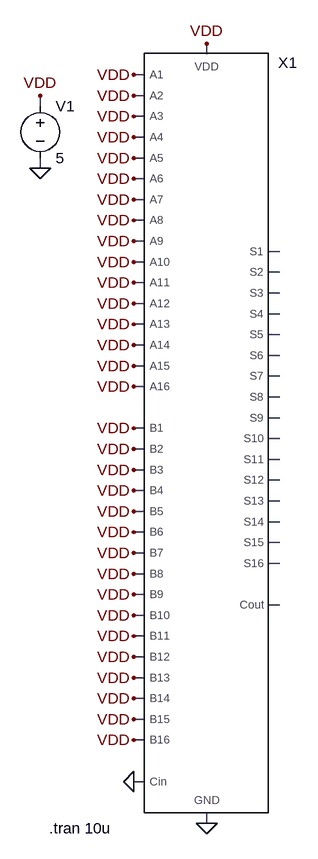
[diagram p0: schematic knowlesTB.asc]
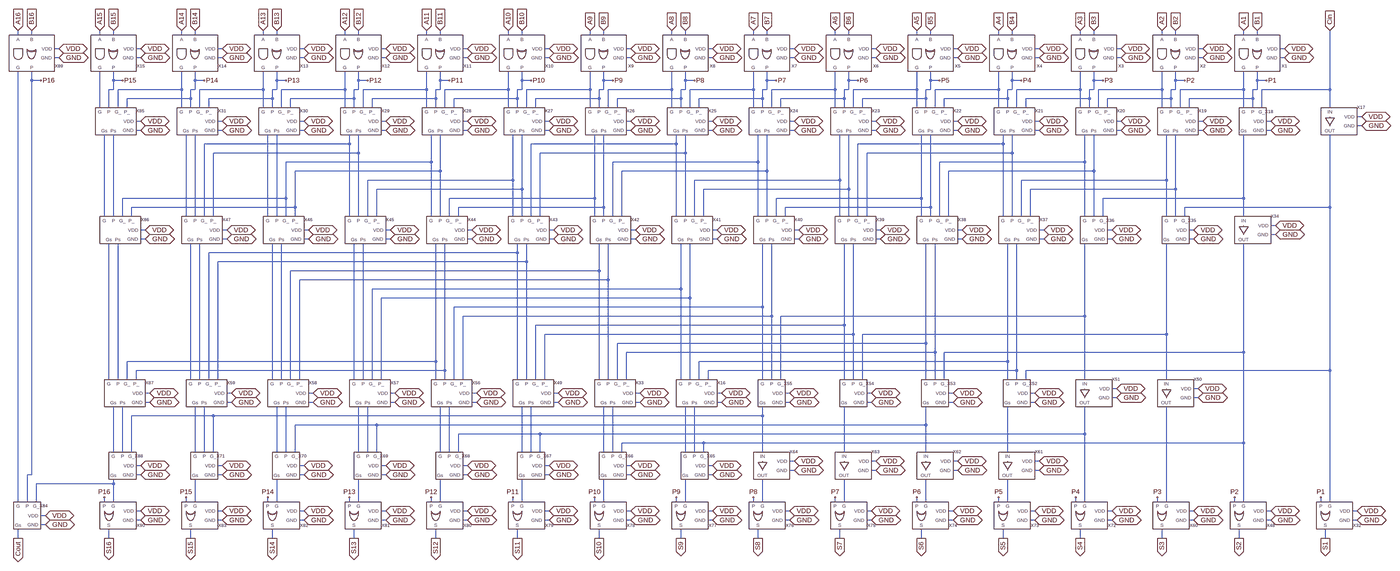
[diagram p1: sub-circuit knowles.asc, whole sheet]
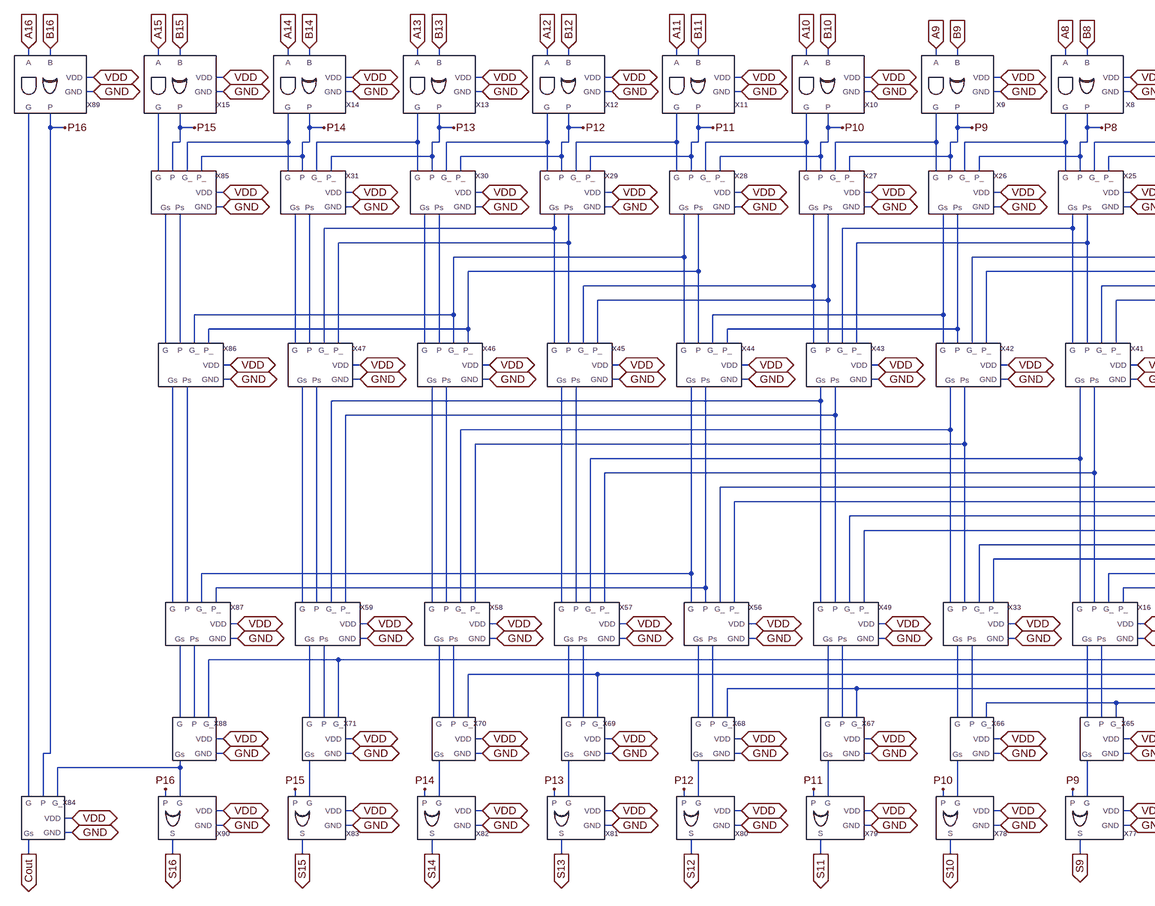
[diagram p2: sub-circuit knowles.asc, part, row 1 of 1, column 1 of 2]
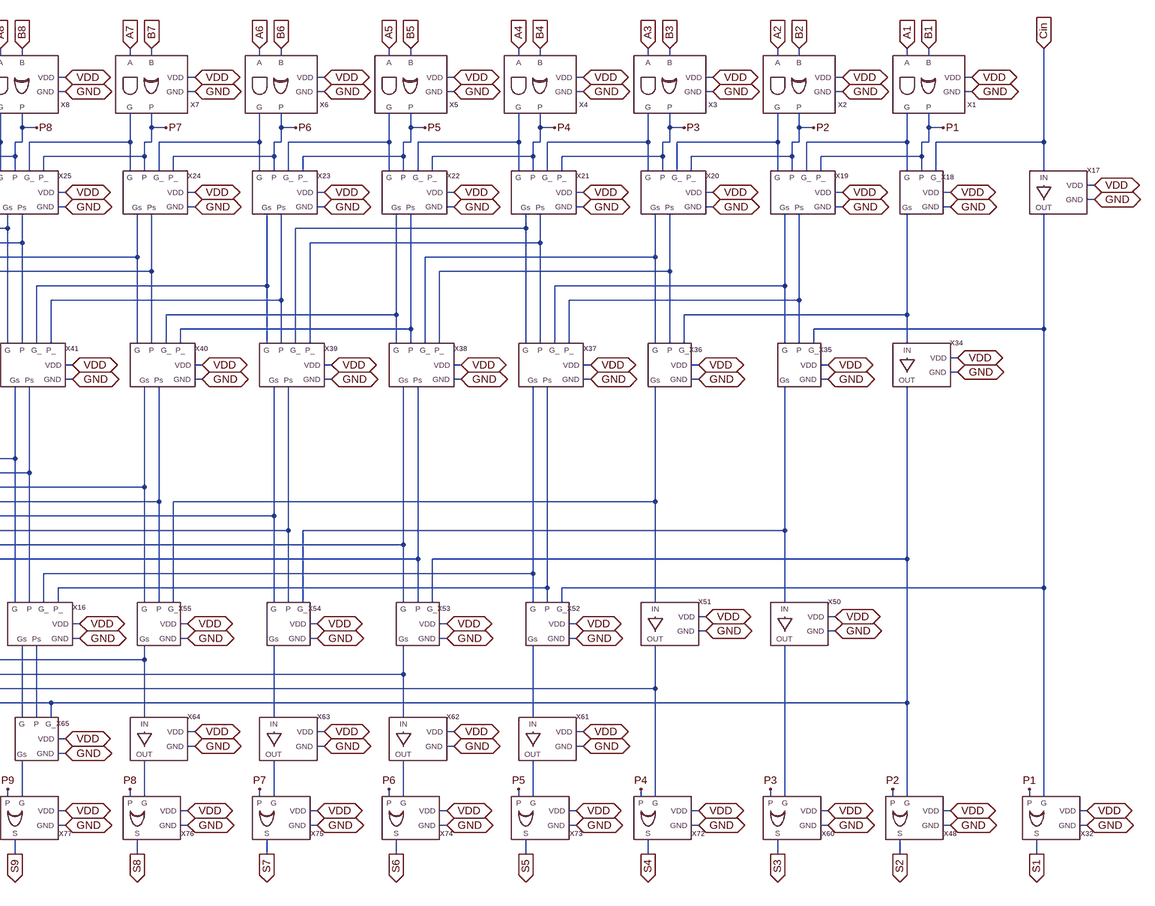
[diagram p3: sub-circuit knowles.asc, part, row 1 of 1, column 2 of 2]
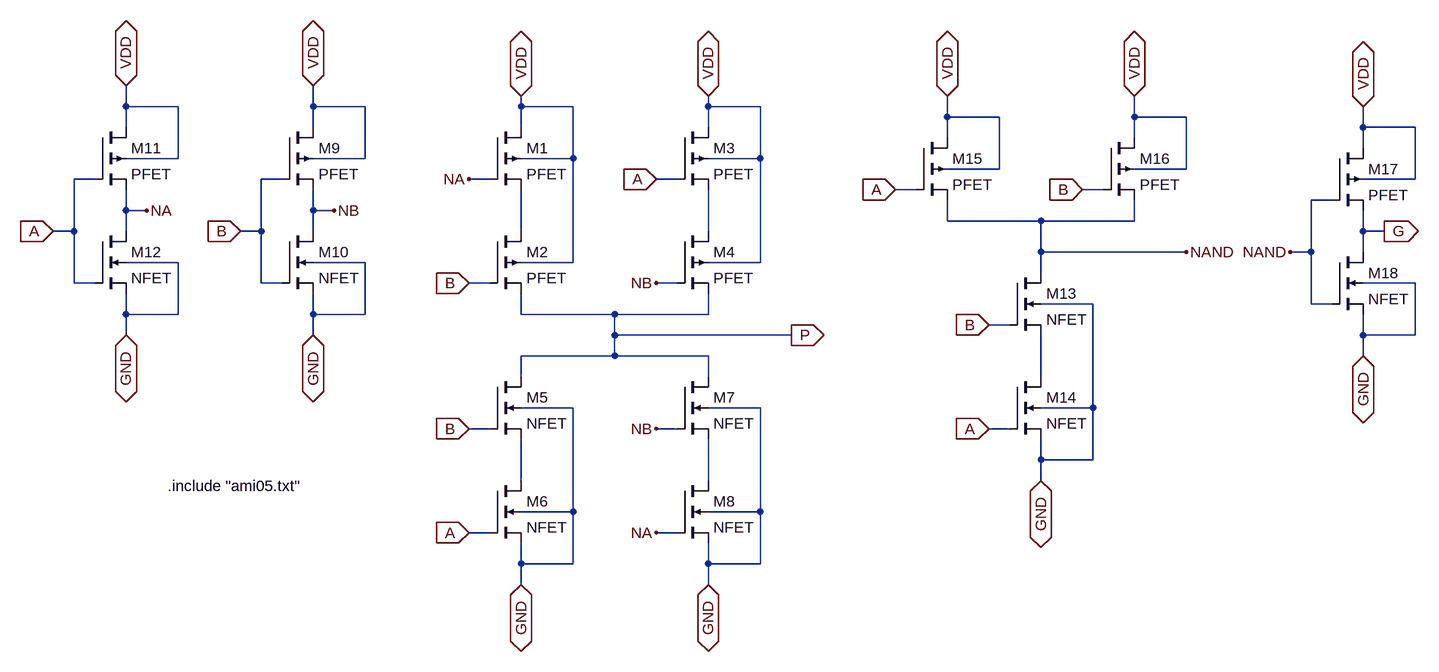
[diagram p4: sub-circuit bitwise.asc]
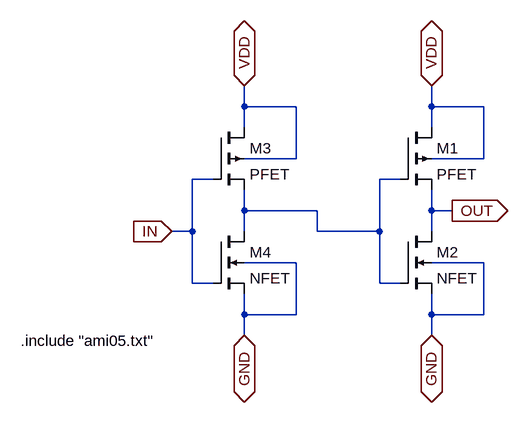
[diagram p5: sub-circuit buffer.asc]
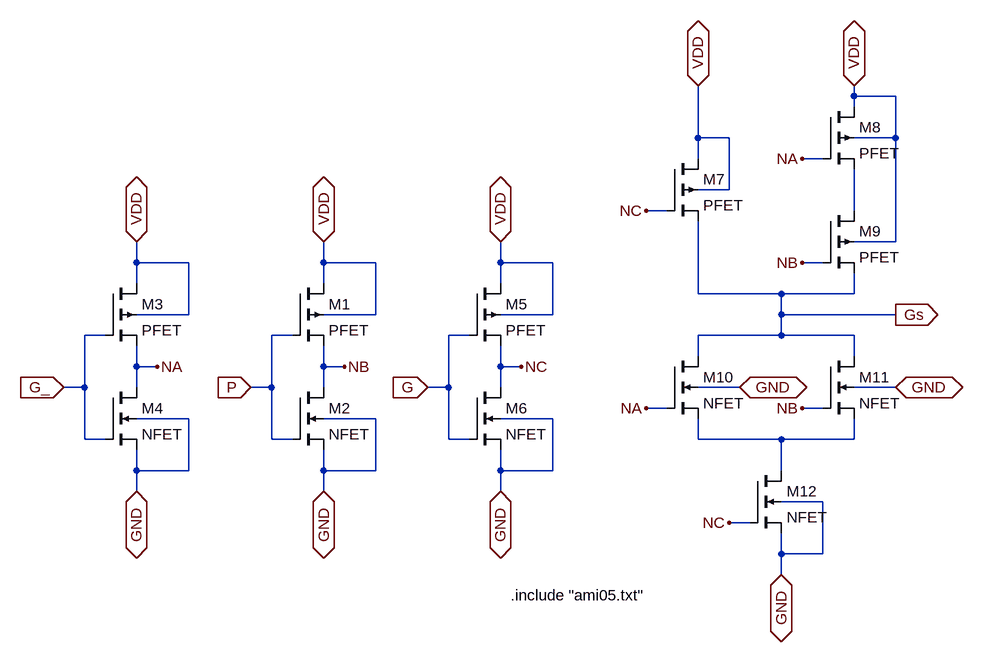
[diagram p6: sub-circuit gray.asc]
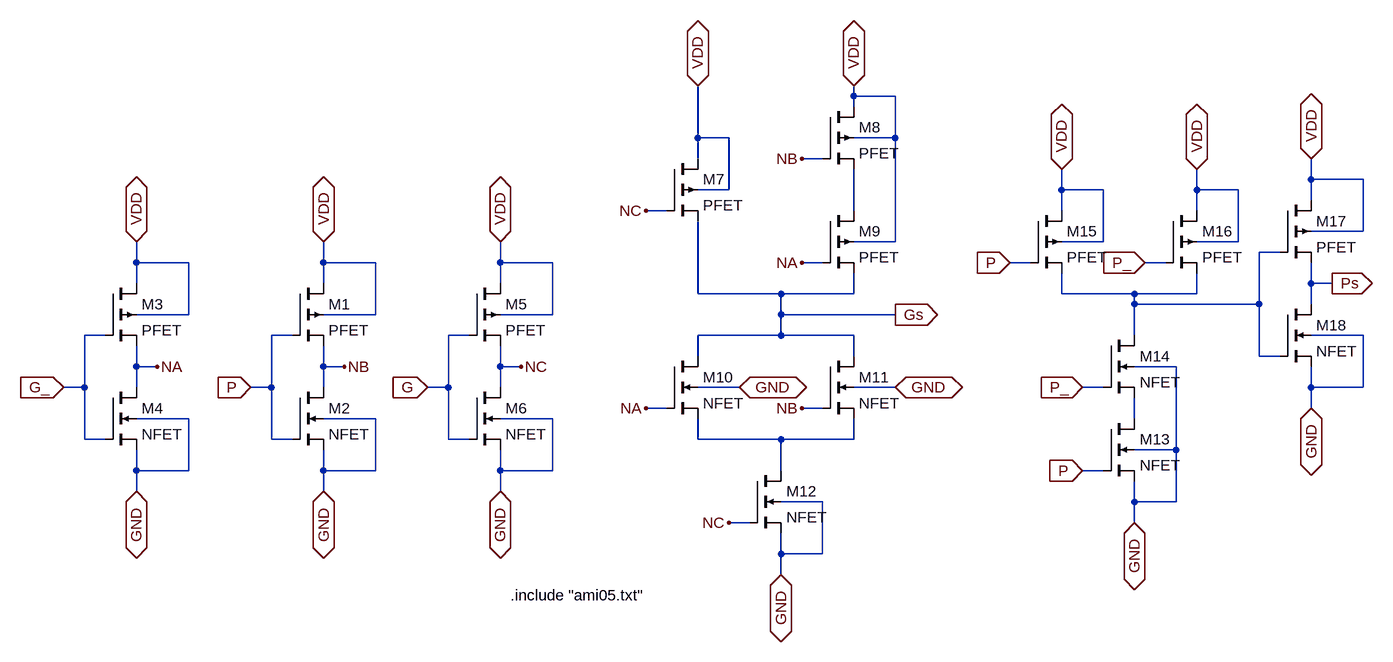
[diagram p7: sub-circuit black.asc]
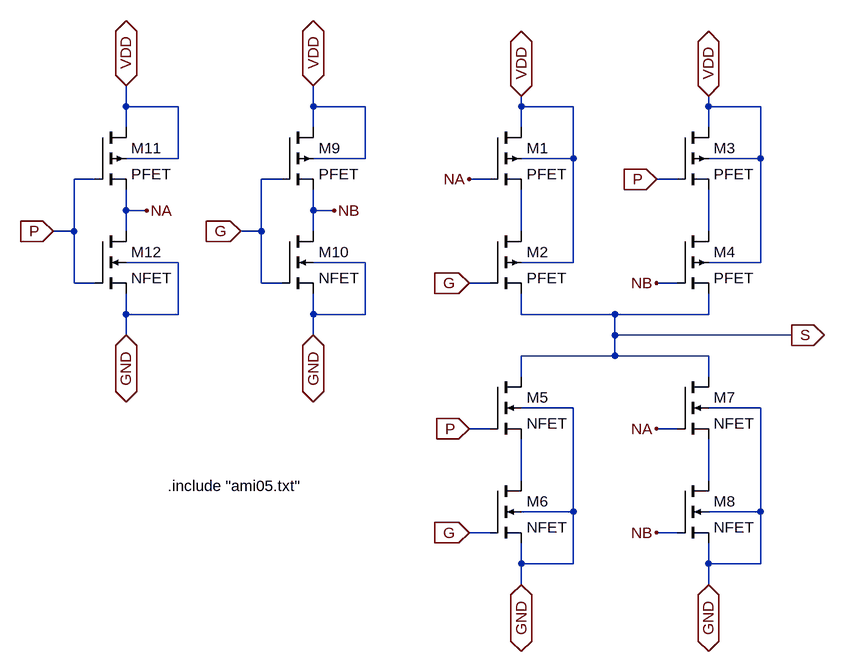
[diagram p8: sub-circuit sum.asc]
knowlesTB.asc, the LTspice schematic file:
Version 4
SHEET 1 880 856
WIRE 192 -368 192 -384
WIRE 96 -336 80 -336
WIRE 96 -304 80 -304
WIRE -64 -288 -64 -304
WIRE 96 -272 80 -272
WIRE 96 -240 80 -240
WIRE 96 -208 80 -208
WIRE -64 -192 -64 -208
WIRE 96 -176 80 -176
WIRE 96 -144 80 -144
WIRE 96 -112 80 -112
WIRE 96 -80 80 -80
WIRE 304 -64 288 -64
WIRE 96 -48 80 -48
WIRE 304 -32 288 -32
WIRE 96 -16 80 -16
WIRE 304 0 288 0
WIRE 96 16 80 16
WIRE 304 32 288 32
WIRE 96 48 80 48
WIRE 304 64 288 64
WIRE 96 80 80 80
WIRE 304 96 288 96
WIRE 96 112 80 112
WIRE 304 128 288 128
WIRE 96 144 80 144
WIRE 304 160 288 160
WIRE 304 192 288 192
WIRE 96 208 80 208
WIRE 304 224 288 224
WIRE 96 240 80 240
WIRE 304 256 288 256
WIRE 96 272 80 272
WIRE 304 288 288 288
WIRE 96 304 80 304
WIRE 304 320 288 320
WIRE 96 336 80 336
WIRE 304 352 288 352
WIRE 96 368 80 368
WIRE 304 384 288 384
WIRE 96 400 80 400
WIRE 304 416 288 416
WIRE 96 432 80 432
WIRE 96 464 80 464
WIRE 304 480 288 480
WIRE 96 496 80 496
WIRE 96 528 80 528
WIRE 96 560 80 560
WIRE 96 592 80 592
WIRE 96 624 80 624
WIRE 96 656 80 656
WIRE 96 688 80 688
WIRE 96 752 80 752
WIRE 192 816 192 800
FLAG 192 816 0
FLAG -64 -192 0
FLAG -64 -304 VDD
FLAG 192 -384 VDD
FLAG 80 -336 VDD
FLAG 80 -304 VDD
FLAG 80 -272 VDD
FLAG 80 -240 VDD
FLAG 80 -208 VDD
FLAG 80 -176 VDD
FLAG 80 -144 VDD
FLAG 80 -112 VDD
FLAG 80 -80 VDD
FLAG 80 -48 VDD
FLAG 80 -16 VDD
FLAG 80 16 VDD
FLAG 80 48 VDD
FLAG 80 80 VDD
FLAG 80 112 VDD
FLAG 80 144 VDD
FLAG 80 208 VDD
FLAG 80 240 VDD
FLAG 80 272 VDD
FLAG 80 304 VDD
FLAG 80 336 VDD
FLAG 80 368 VDD
FLAG 80 400 VDD
FLAG 80 432 VDD
FLAG 80 464 VDD
FLAG 80 496 VDD
FLAG 80 528 VDD
FLAG 80 560 VDD
FLAG 80 592 VDD
FLAG 80 624 VDD
FLAG 80 656 VDD
FLAG 80 688 VDD
FLAG 80 752 0
SYMBOL knowles 800 160 R0
SYMATTR InstName X1
SYMBOL voltage -64 -304 R0
WINDOW 123 0 0 Left 0
WINDOW 39 0 0 Left 0
SYMATTR InstName V1
SYMATTR Value 5
TEXT -50 824 Left 2 !.tran 10u

The netlist it stands for:
* knowlesTB.asc
XX1 VDD VDD VDD VDD VDD VDD VDD VDD VDD VDD VDD VDD VDD VDD VDD VDD VDD VDD VDD VDD VDD VDD VDD VDD VDD VDD VDD VDD VDD VDD VDD VDD 0 N017 0 N001 N010 N011 N012 N013 N014 N015 N016 N002 N003 N004 N005 N006 N007 N008 N009 VDD knowles
V1 VDD 0 5

* block symbol definitions
.subckt knowles A1 A10 A11 A12 A13 A14 A15 A16 A2 A3 A4 A5 A6 A7 A8 A9 B1 B10 B11 B12 B13 B14 B15 B16 B2 B3 B4 B5 B6 B7 B8 B9 Cin Cout GND S1 S10 S11 S12 S13 S14 S15 S16 S2 S3 S4 S5 S6 S7 S8 S9 VDD
XX1 A1 B1 N014 GND P1 VDD bitwise
XX2 A2 B2 N013 GND P2 VDD bitwise
XX3 A3 B3 N012 GND P3 VDD bitwise
XX4 A4 B4 N011 GND P4 VDD bitwise
XX5 A5 B5 N010 GND P5 VDD bitwise
XX6 A6 B6 N009 GND P6 VDD bitwise
XX7 A7 B7 N008 GND P7 VDD bitwise
XX8 A8 B8 N007 GND P8 VDD bitwise
XX9 A9 B9 N006 GND P9 VDD bitwise
XX10 A10 B10 N005 GND P10 VDD bitwise
XX11 A11 B11 N004 GND P11 VDD bitwise
XX12 A12 B12 N003 GND P12 VDD bitwise
XX13 A13 B13 N002 GND P13 VDD bitwise
XX14 A14 B14 N001 GND P14 VDD bitwise
XX15 A15 B15 N015 GND P15 VDD bitwise
XX17 Cin GND N039 VDD buffer
XX18 N014 Cin P1 GND N036 VDD gray
XX19 N013 N014 P2 P1 GND N030 N033 VDD black
XX20 N012 N013 P3 P2 GND N024 N027 VDD black
XX21 N011 N012 P4 P3 GND N018 N021 VDD black
XX22 N010 N011 P5 P4 GND N035 N038 VDD black
XX23 N009 N010 P6 P5 GND N029 N032 VDD black
XX24 N008 N009 P7 P6 GND N023 N026 VDD black
XX25 N007 N008 P8 P7 GND N017 N020 VDD black
XX26 N006 N007 P9 P8 GND N034 N037 VDD black
XX27 N005 N006 P10 P9 GND N028 N031 VDD black
XX28 N004 N005 P11 P10 GND N022 N025 VDD black
XX29 N003 N004 P12 P11 GND N016 N019 VDD black
XX30 N002 N003 P13 P12 GND N044 N045 VDD black
XX31 N001 N002 P14 P13 GND N042 N043 VDD black
XX34 N036 GND N060 VDD buffer
XX35 N030 N039 N033 GND N057 VDD gray
XX36 N024 N036 N027 GND N054 VDD gray
XX37 N018 N030 N021 N033 GND N062 N064 VDD black
XX38 N035 N024 N038 N027 GND N058 N059 VDD black
XX39 N029 N018 N032 N021 GND N055 N056 VDD black
XX40 N023 N035 N026 N038 GND N052 N053 VDD black
XX41 N017 N029 N020 N032 GND N050 N051 VDD black
XX42 N034 N023 N037 N026 GND N048 N049 VDD black
XX43 N028 N017 N031 N020 GND N046 N047 VDD black
XX44 N022 N034 N025 N037 GND N061 N063 VDD black
XX45 N016 N028 N019 N031 GND N071 N072 VDD black
XX46 N044 N022 N045 N025 GND N069 N070 VDD black
XX47 N042 N016 N043 N019 GND N067 N068 VDD black
XX50 N057 GND N107 VDD buffer
XX51 N054 GND N075 VDD buffer
XX52 N062 N039 N064 GND N093 VDD gray
XX53 N058 N060 N059 GND N074 VDD gray
XX54 N055 N057 N056 GND N092 VDD gray
XX55 N052 N054 N053 GND N073 VDD gray
XX16 N050 N062 N051 N064 GND N090 N091 VDD black
XX33 N048 N058 N049 N059 GND N088 N089 VDD black
XX49 N046 N055 N047 N056 GND N086 N087 VDD black
XX56 N061 N052 N063 N053 GND N084 N085 VDD black
XX57 N071 N050 N072 N051 GND N082 N083 VDD black
XX58 N069 N048 N070 N049 GND N080 N081 VDD black
XX59 N067 N046 N068 N047 GND N078 N079 VDD black
XX61 N093 GND N106 VDD buffer
XX62 N074 GND N105 VDD buffer
XX63 N092 GND N104 VDD buffer
XX64 N073 GND N103 VDD buffer
XX65 N090 N060 N091 GND N102 VDD gray
XX66 N088 N060 N089 GND N101 VDD gray
XX67 N086 N075 N087 GND N100 VDD gray
XX68 N084 N075 N085 GND N099 VDD gray
XX69 N082 N074 N083 GND N098 VDD gray
XX70 N080 N074 N081 GND N097 VDD gray
XX71 N078 N073 N079 GND N096 VDD gray
XX32 P1 N039 GND S1 VDD sum
XX48 P2 N060 GND S2 VDD sum
XX60 P3 N107 GND S3 VDD sum
XX72 P4 N075 GND S4 VDD sum
XX73 P5 N106 GND S5 VDD sum
XX74 P6 N105 GND S6 VDD sum
XX75 P7 N104 GND S7 VDD sum
XX76 P8 N103 GND S8 VDD sum
XX77 P9 N102 GND S9 VDD sum
XX78 P10 N101 GND S10 VDD sum
XX79 P11 N100 GND S11 VDD sum
XX80 P12 N099 GND S12 VDD sum
XX81 P13 N098 GND S13 VDD sum
XX82 P14 N097 GND S14 VDD sum
XX83 P15 N096 GND S15 VDD sum
XX84 N095 N094 P16 GND Cout VDD gray
XX85 N015 N001 P15 P14 GND N040 N041 VDD black
XX86 N040 N022 N041 N025 GND N065 N066 VDD black
XX87 N065 N061 N066 N063 GND N076 N077 VDD black
XX88 N076 N073 N077 GND N094 VDD gray
XX89 A16 B16 N095 GND P16 VDD bitwise
XX90 P16 N094 GND S16 VDD sum
.ends knowles

.subckt bitwise A B G GND P VDD
M1 VDD NA N001 VDD PFET l=0.6u w=6u
M2 N001 B P VDD PFET l=0.6u w=6u
M3 VDD A N002 VDD PFET l=0.6u w=6u
M4 N002 NB P VDD PFET l=0.6u w=6u
M5 P B N004 GND NFET l=0.6u w=3u
M6 N004 A GND GND NFET l=0.6u w=3u
M7 P NB N005 GND NFET l=0.6u w=3u
M8 N005 NA GND GND NFET l=0.6u w=3u
M9 VDD B NB VDD PFET l=0.6u w=3u
M10 NB B GND GND NFET l=0.6u w=1.5u
M11 VDD A NA VDD PFET l=0.6u w=3u
M12 NA A GND GND NFET l=0.6u w=1.5u
M13 NAND B N003 GND NFET l=0.6u w=3u
M14 N003 A GND GND NFET l=0.6u w=3u
M15 VDD A NAND VDD PFET l=0.6u w=3u
M16 VDD B NAND VDD PFET l=0.6u w=3u
M17 VDD NAND G VDD PFET l=0.6u w=3u
M18 G NAND GND GND NFET l=0.6u w=1.5u
.include "ami05.txt"
.ends bitwise

.subckt buffer IN GND OUT VDD
M1 VDD N001 OUT VDD PFET l=0.6u w=3u
M2 OUT N001 GND GND NFET l=0.6u w=1.5u
M3 VDD IN N001 VDD PFET l=0.6u w=3u
M4 N001 IN GND GND NFET l=0.6u w=1.5u
.include "ami05.txt"
.ends buffer

.subckt gray G G_ P GND Gs VDD
M1 VDD P NB VDD PFET l=0.6u w=3u
M2 NB P GND GND NFET l=0.6u w=1.5u
M3 VDD G_ NA VDD PFET l=0.6u w=3u
M4 NA G_ GND GND NFET l=0.6u w=1.5u
M5 VDD G NC VDD PFET l=0.6u w=3u
M6 NC G GND GND NFET l=0.6u w=1.5u
M7 VDD NC Gs VDD PFET l=0.6u w=3u
M8 VDD NA N001 VDD PFET l=0.6u w=3u
M9 N001 NB Gs VDD PFET l=0.6u w=3u
M10 Gs NA N002 GND NFET l=0.6u w=1.5u
M11 Gs NB N002 GND NFET l=0.6u w=1.5u
M12 N002 NC GND GND NFET l=0.6u w=1.5u
.include "ami05.txt"
.ends gray

.subckt black G G_ P P_ GND Gs Ps VDD
M1 VDD P NB VDD PFET l=0.6u w=3u
M2 NB P GND GND NFET l=0.6u w=1.5u
M3 VDD G_ NA VDD PFET l=0.6u w=3u
M4 NA G_ GND GND NFET l=0.6u w=1.5u
M5 VDD G NC VDD PFET l=0.6u w=3u
M6 NC G GND GND NFET l=0.6u w=1.5u
M7 VDD NC Gs VDD PFET l=0.6u w=6u
M8 VDD NB N001 VDD PFET l=0.6u w=6u
M9 N001 NA Gs VDD PFET l=0.6u w=6u
M10 Gs NA N004 GND NFET l=0.6u w=3u
M11 Gs NB N004 GND NFET l=0.6u w=3u
M12 N004 NC GND GND NFET l=0.6u w=3u
M13 N003 P GND GND NFET l=0.6u w=3u
M14 N002 P_ N003 GND NFET l=0.6u w=3u
M15 VDD P N002 VDD PFET l=0.6u w=3u
M16 VDD P_ N002 VDD PFET l=0.6u w=3u
M17 VDD N002 Ps VDD PFET l=0.6u w=3u
M18 Ps N002 GND GND NFET l=0.6u w=1.5u
.include "ami05.txt"
.ends black

.subckt sum P G GND S VDD
M1 VDD NA N001 VDD PFET l=0.6u w=6u
M2 N001 G S VDD PFET l=0.6u w=6u
M3 VDD P N002 VDD PFET l=0.6u w=6u
M4 N002 NB S VDD PFET l=0.6u w=6u
M5 S P N003 GND NFET l=0.6u w=3u
M6 N003 G GND GND NFET l=0.6u w=3u
M7 S NA N004 GND NFET l=0.6u w=3u
M8 N004 NB GND GND NFET l=0.6u w=3u
M9 VDD G NB VDD PFET l=0.6u w=3u
M10 NB G GND GND NFET l=0.6u w=1.5u
M11 VDD P NA VDD PFET l=0.6u w=3u
M12 NA P GND GND NFET l=0.6u w=1.5u
.include "ami05.txt"
.ends sum

.model NMOS NMOS
.model PMOS PMOS
.lib standard.mos
.tran 10u
.backanno
.end